# EAGLE design sensor-board (EAGLE 9.3.1)
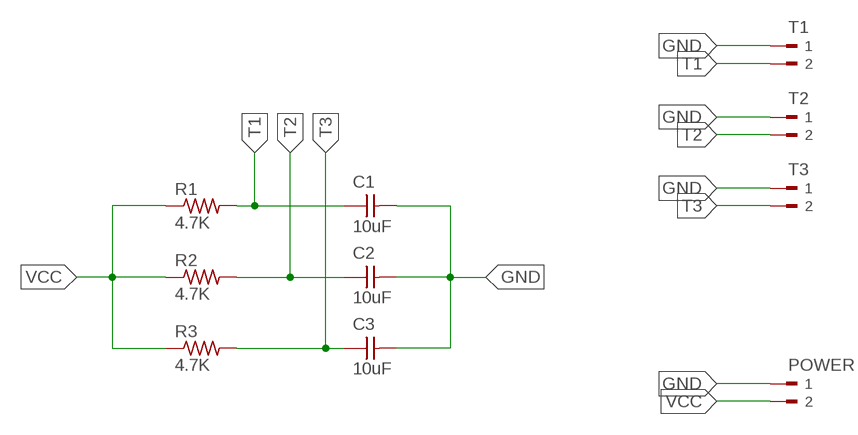
[diagram p0: schematic, sheet 1]

## Parts
C1  10uF  UNPOLARIZED_CAPACITOR1206  [1206]
C2  10uF  UNPOLARIZED_CAPACITOR1206  [1206]
C3  10uF  UNPOLARIZED_CAPACITOR1206  [1206]
POWER  PM5.08/2/90BLK  [WEIDMULLER_PM5.08_2]
R1  4.7K  RES-US1206FAB  [R1206FAB]
R2  4.7K  RES-US1206FAB  [R1206FAB]
R3  4.7K  RES-US1206FAB  [R1206FAB]
T1  PM5.08/2/90BLK  [WEIDMULLER_PM5.08_2]
T2  PM5.08/2/90BLK  [WEIDMULLER_PM5.08_2]
T3  PM5.08/2/90BLK  [WEIDMULLER_PM5.08_2]

## Nets
GND: C1.2 C2.2 C3.2 POWER.1 T1.1 T2.1 T3.1
T1: C1.1 R1.2 T1.2
T2: C2.1 R2.2 T2.2
T3: C3.1 R3.2 T3.2
VCC: POWER.2 R1.1 R2.1 R3.1

## Library data of the parts
C1-C3 = FAB_Hello:UNPOLARIZED_CAPACITOR: unpolarized_capacitor
POWER T1-T3 = WEIDMULLER-PM5.08_2_90BLK:PM5.08/2/90BLK: TERMINAL BLOCK, SIDE ENTRY, 2WAY; MPN: PM5.08/2/90 BLK; OC_FARNELL: 1131855; OC_NEWARK: 26M1980; PACKAGE: TH-R/A; SUPPLIER: WEIDMULLER
R1-R3 = fab:RES-US: Resistor (US Symbol) Variants with postfix FAB are widened to allow the routing of internal traces

## Board
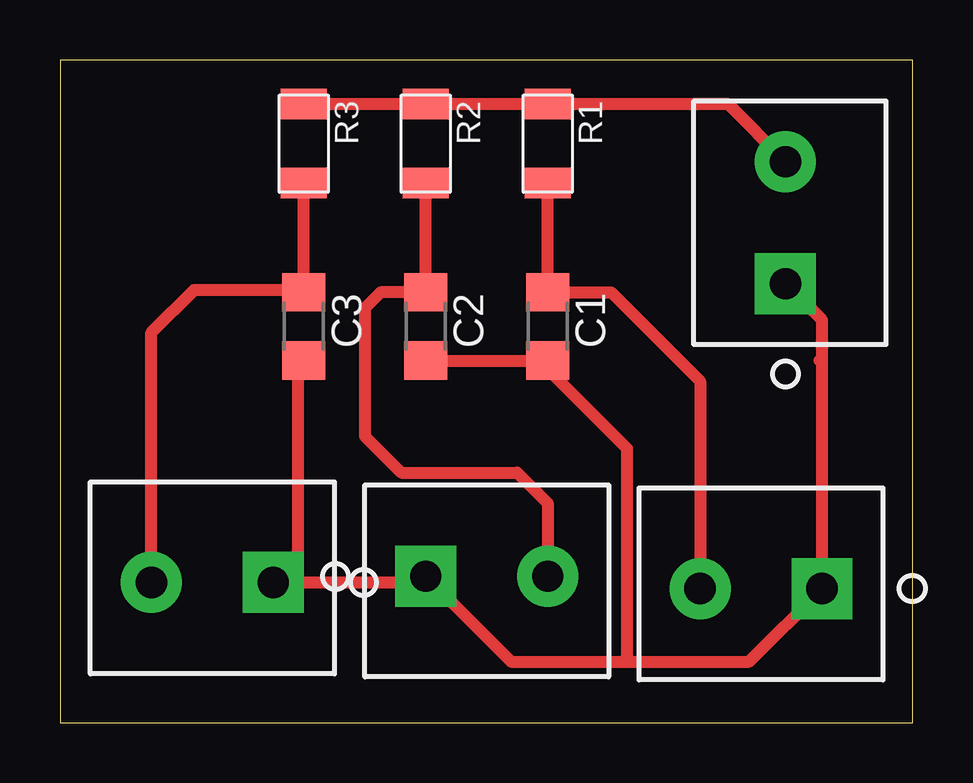
[diagram p1: board, top side]

Size 35.54 x 27.61 mm. Coordinates in mm from the lower left corner, seen from the top.
Outline: 0,0 35.54,0 35.54,27.61 0,27.61 0,0
Copper layers (1*16): Top 0.035mm / dielectric 1.5mm / Bottom 0.035mm
Design rules "default": minimum track width 6mil, minimum drill 0.35mm, track to track 6mil, track to pad 6mil, pad to pad 6mil, via to via 6mil, smd to smd 6mil, copper to edge 40mil, drill to drill 6mil, minimum pad ring 10mil, minimum via ring 8mil, stop-mask expansion 4mil, vias tented up to drill 0mil, thermal gap 10mil

### Footprints (pad centres in the part's own frame; a part is rotated, then mirrored left to right if it is on the bottom)
1206 = smd 1.6 x 1.803: 1 -1.422,0; 2 1.422,0
WEIDMULLER_PM5.08_2 = drill 1.3 pad 2.54 square: 1 -2.54,0 | drill 1.3 pad 2.54: 2 2.54,0
R1206FAB = smd 1.27 x 1.905: 1 -1.651,0; 2 1.651,0

### Placement (x,y rotation side)
C1  20.32,16.51 270 top
C2  15.24,16.51 270 top
C3  10.16,16.51 270 top
POWER  30.23,20.83 90 top
R1  20.32,24.13 270 top
R2  15.24,24.13 270 top
R3  10.16,24.13 270 top
T1  29.21,5.59 180 top
T2  17.78,6.1 0 top
T3  6.35,5.84 180 top

### Tracks (layer width: path | path; a pad name or v marks a point on that pad's centre or on a via)
GND
  Top 0.508: C2.2 C1.2 20.32,14.73 23.62,11.43 23.62,2.54 | 31.75,14.99 T1.1 28.7,2.54 23.62,2.54 | 31.75,14.99 31.75,16.76 POWER.1 | 31.65,15.09 31.75,14.99 | T3.1 9.91,5.84 | 9.91,5.84 14.99,5.84 T2.1 18.8,2.54 23.62,2.54 | C3.2 9.91,14.83 9.91,5.84
T1
  Top 0.508: R1.2 C1.1 22.96,17.93 26.67,14.22 T1.2
T2
  Top 0.508: R2.2 C2.1 13.36,17.93 12.7,17.27 12.7,11.94 14.22,10.41 19.05,10.41 20.32,9.14 T2.2
T3
  Top 0.508: R3.2 C3.1 10.06,18.03 5.59,18.03 3.81,16.26 T3.2
VCC
  Top 0.508: R3.1 R2.1 R1.1 27.81,25.78 POWER.2